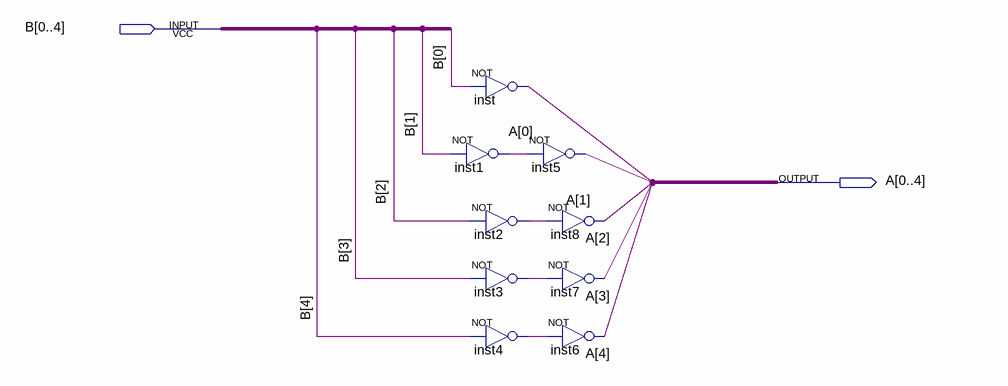
[diagram p0: schematic sheet]
// Quartus schematic inversorsinal.bdf as structural Verilog: 9 symbols, 2 pins
module inversorsinal (
  input  [0:4] B,
  output [0:4] A
);

  wire inst1_out, inst2_out, inst3_out, inst4_out;

  not inst (A[0], B[0]);
  not inst1 (inst1_out, B[1]);
  not inst2 (inst2_out, B[2]);
  not inst3 (inst3_out, B[3]);
  not inst4 (inst4_out, B[4]);
  not inst5 (A[1], inst1_out);
  not inst8 (A[2], inst2_out);
  not inst7 (A[3], inst3_out);
  not inst6 (A[4], inst4_out);
endmodule
